# EAGLE design rcstick-f-pico2 (EAGLE 9.6.2)
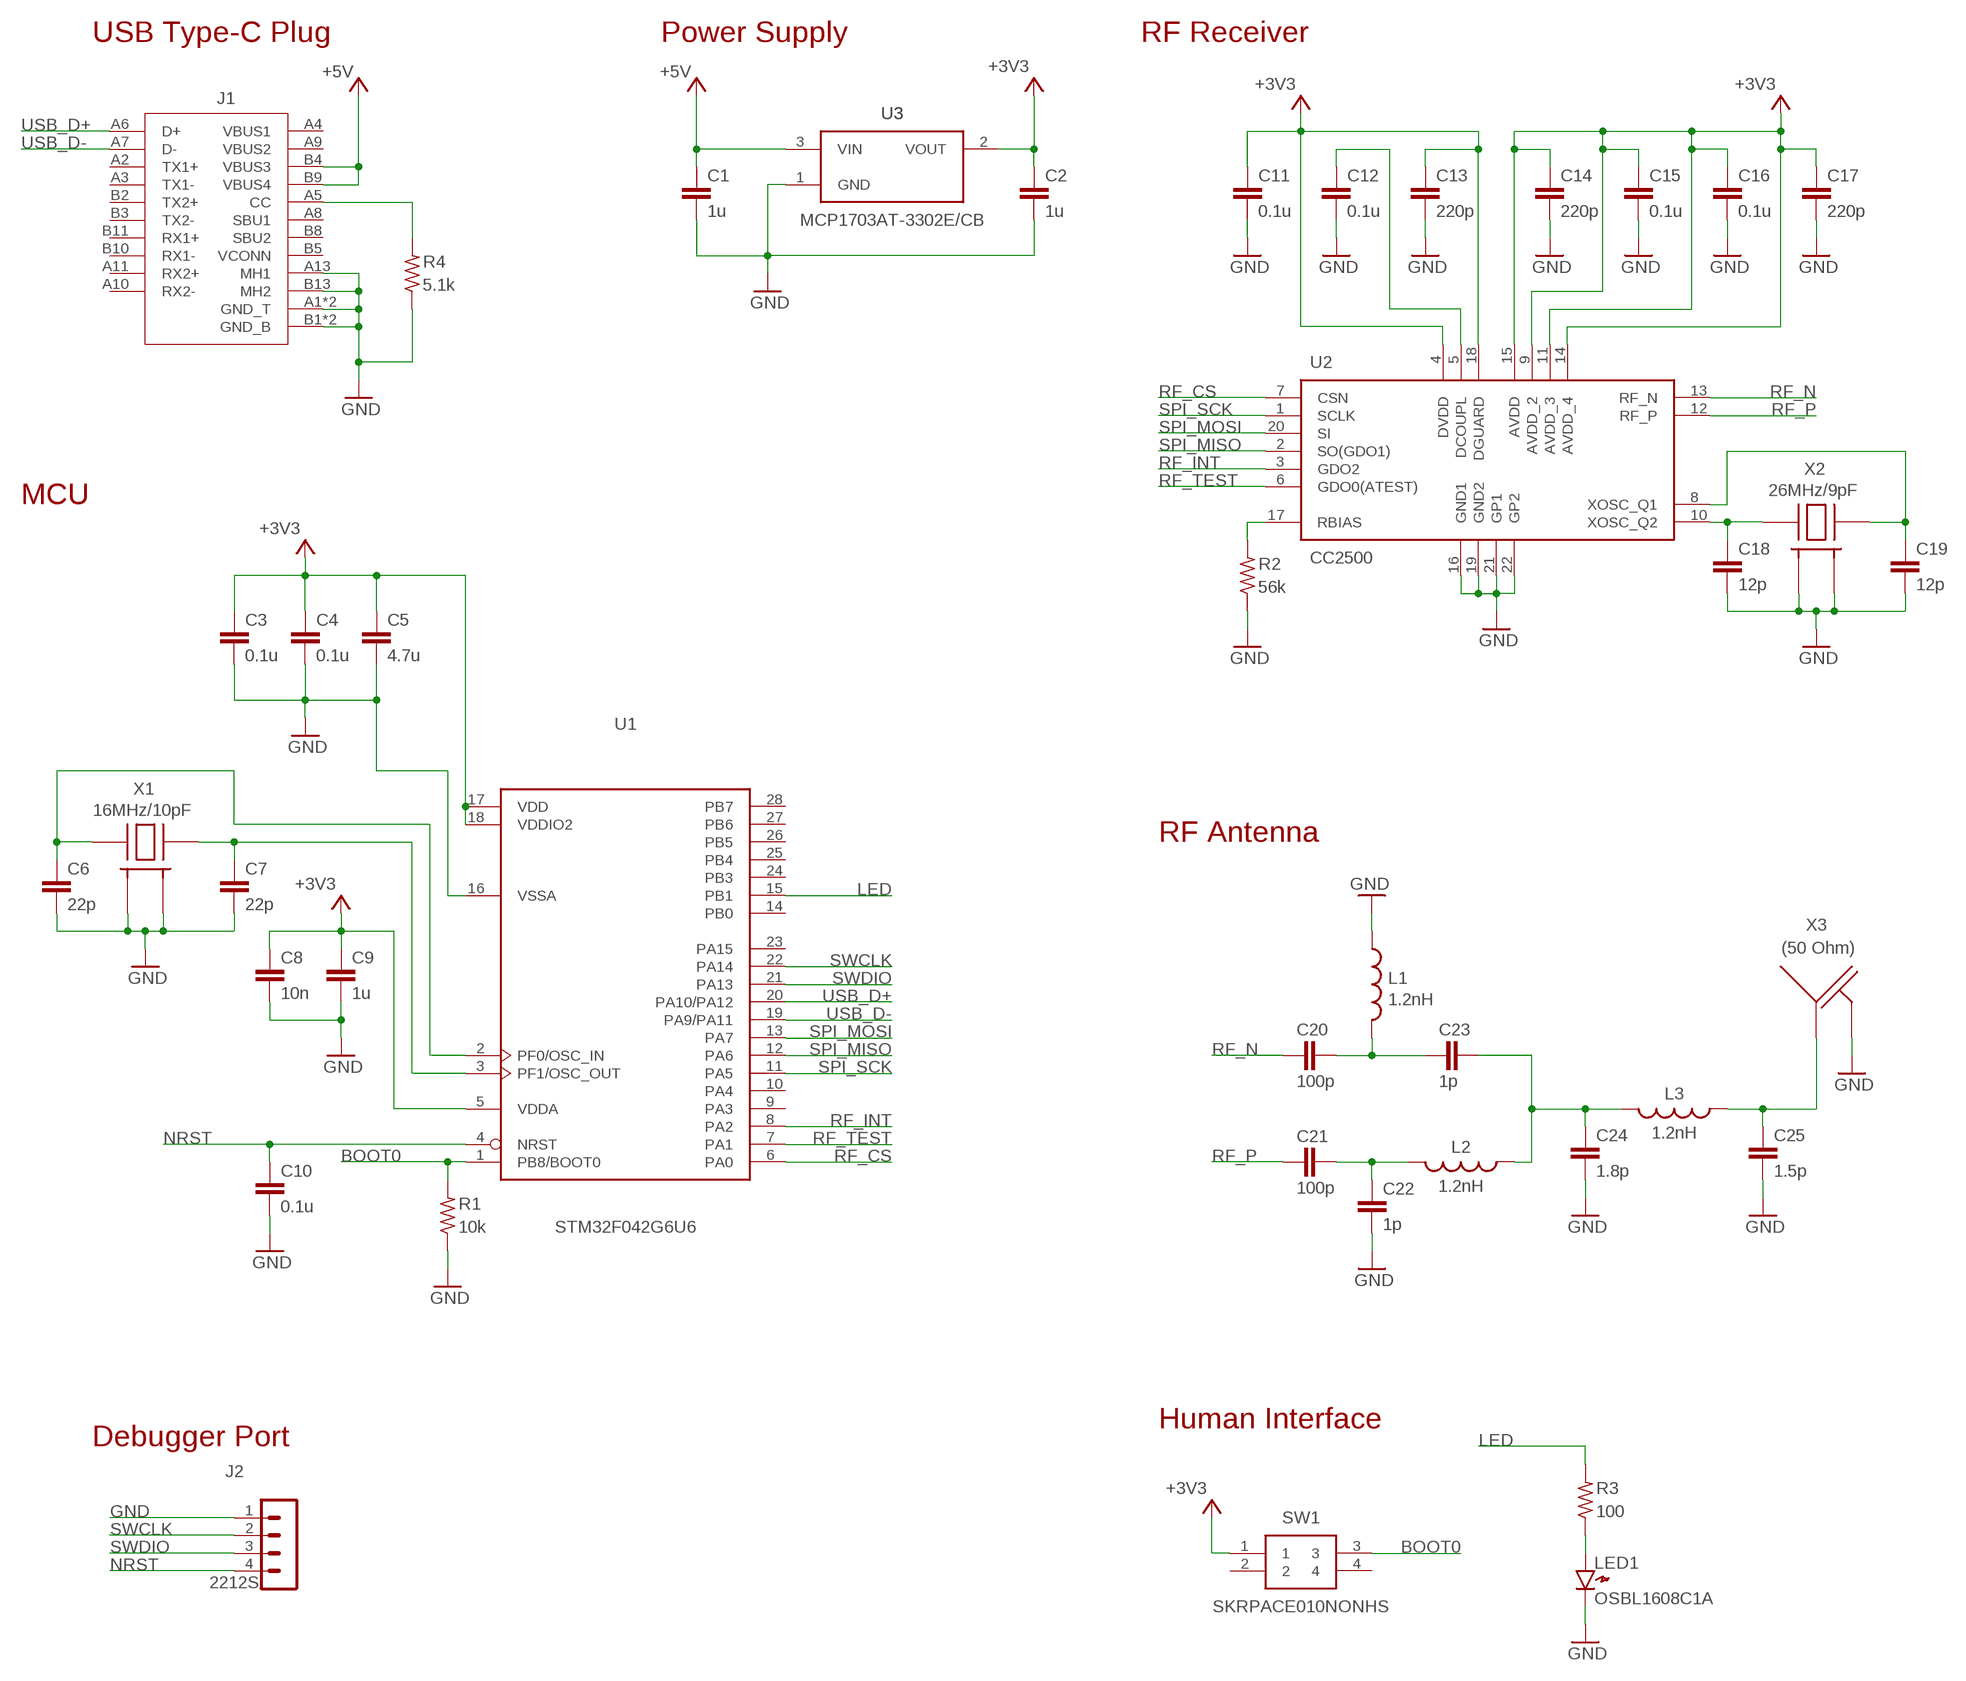
[diagram p0: schematic, sheet 1]

## Parts
C1  1u  RCL_C-EUC0402-HS  [RCL_C0402_HS]
C2  1u  RCL_C-EUC0402-HS  [RCL_C0402_HS]
C3  0.1u  RCL_C-EUC0402-HS  [RCL_C0402_HS]
C4  0.1u  RCL_C-EUC0402-HS  [RCL_C0402_HS]
C5  4.7u  RCL_C-EUC0402-HS  [RCL_C0402_HS]
C6  22p  RCL_C-EUC0402-HS  [RCL_C0402_HS]
C7  22p  RCL_C-EUC0402-HS  [RCL_C0402_HS]
C8  10n  RCL_C-EUC0402-HS  [RCL_C0402_HS]
C9  1u  RCL_C-EUC0402-HS  [RCL_C0402_HS]
C10  0.1u  RCL_C-EUC0402-HS  [RCL_C0402_HS]
C11  0.1u  RCL_C-EUC0402-HS  [RCL_C0402_HS]
C12  0.1u  RCL_C-EUC0402-HS  [RCL_C0402_HS]
C13  220p  RCL_C-EUC0402-HS  [RCL_C0402_HS]
C14  220p  RCL_C-EUC0402-HS  [RCL_C0402_HS]
C15  0.1u  RCL_C-EUC0402-HS  [RCL_C0402_HS]
C16  0.1u  RCL_C-EUC0402-HS  [RCL_C0402_HS]
C17  220p  RCL_C-EUC0402-HS  [RCL_C0402_HS]
C18  12p  RCL_C-EUC0402-HS  [RCL_C0402_HS]
C19  12p  RCL_C-EUC0402-HS  [RCL_C0402_HS]
C20  100p  RCL_C-EUC0402-HS  [RCL_C0402_HS]
C21  100p  RCL_C-EUC0402-HS  [RCL_C0402_HS]
C22  1p  RCL_C-EUC0402-HS  [RCL_C0402_HS]
C23  1p  RCL_C-EUC0402-HS  [RCL_C0402_HS]
C24  1.8p  RCL_C-EUC0402-HS  [RCL_C0402_HS]
C25  1.5p  RCL_C-EUC0402-HS  [RCL_C0402_HS]
J1  USB-TYPEC-1054440001-HS  [USB-TYPEC-1054440001-HS]
J2  2212S  53047-0410  [53047-0410]
L1  1.2nH  RCL_L-USL0402-HS  [RCL_L0402_HS]
L2  1.2nH  RCL_L-USL0402-HS  [RCL_L0402_HS]
L3  1.2nH  RCL_L-USL0402-HS  [RCL_L0402_HS]
LED1  OSBL1608C1A  LED1608_NOHS  [LED1608NONHS]
R1  10k  RCL_R-US_R0402-HS  [RCL_R0402_HS]
R2  56k  RCL_R-US_R0402-HS  [RCL_R0402_HS]
R3  100  RCL_R-US_R0402-HS  [RCL_R0402_HS]
R4  5.1k  RCL_R-US_R0402-HS  [RCL_R0402_HS]
SW1  SKRPACE010NONHS  [SMT(4.2X3.2)_ORG]
U1  STM32F042G6U6  STM32F042GU  [UFQFPN28]
U2  CC2500  [CC2500-RTY1_CC2500]
U3  MCP1703AT-3302E/CB  LDO-REGULATOR_NOHS  [SOT23_NOHS]
X1  16MHz/10pF  CRYSTAL3225  [CRYSTAL3225]
X2  26MHz/9pF  CRYSTAL3225  [CRYSTAL3225]
X3  (50 Ohm)  2.4GHZ-INVERED-FSMALL-FLIP  [2.4GHZ-INVERTED-F-SMALL-FLIP]

## Nets
+3V3 [pwr]: C2.1 C3.1 C4.1 C5.1 C8.1 C9.1 C11.1 C13.1 C14.1 C15.1 C16.1 C17.1 SW1.1 U1.5(VDDA) U1.17(VDD) U1.18(VDDIO2) U2.4(DVDD) U2.9(AVDD_2) U2.11(AVDD_3) U2.14(AVDD_4) U2.15(AVDD) U2.18(DGUARD) U3.2(VOUT)
+5V [pwr]: C1.1 J1.B4(VBUS3) J1.B9(VBUS4) U3.3(VIN)
BOOT0: R1.2 SW1.3 U1.1(PB8/BOOT0)
CC: J1.A5(CC) R4.2
DCOUPL: C12.1 U2.5(DCOUPL)
GND [gnd]: C1.2 C2.2 C3.2 C4.2 C5.2 C6.2 C7.2 C8.2 C9.2 C10.2 C11.2 C12.2 C13.2 C14.2 C15.2 C16.2 C17.2 C18.2 C19.2 C22.2 C24.2 C25.2 J1.A1(GND_T) J1.A12(GND_T) J1.A13(MH1) J1.B1(GND_B) J1.B12(GND_B) J1.B13(MH2) J2.1 L1.1 LED1.K R1.1 R2.1 R4.1 U1.16(VSSA) U2.16(GND1) U2.19(GND2) U2.21(GP1) U2.22(GP2) U3.1(GND) X1.2(GND_1) X1.4(GND_2) X2.2(GND_1) X2.4(GND_2) X3.2(GND)
LED: R3.2 U1.15(PB1)
N$1: LED1.A R3.1
N$5: C20.2 C23.1 L1.2
N$9: C21.2 C22.1 L2.2
N$10: C23.2 C24.1 L2.1 L3.2
N$11: C25.1 L3.1 X3.1(ANT)
NRST: C10.1 J2.4 U1.4(NRST)
OSC_IN: C6.1 U1.2(PF0/OSC_IN) X1.1(HOT_1)
OSC_OUT: C7.1 U1.3(PF1/OSC_OUT) X1.3(HOT_2)
RBIAS: R2.2 U2.17(RBIAS)
RF_CS: U1.6(PA0) U2.7(CSN)
RF_INT: U1.8(PA2) U2.3(GDO2)
RF_N: C20.1 U2.13(RF_N)
RF_P: C21.1 U2.12(RF_P)
RF_TEST: U1.7(PA1) U2.6(GDO0(ATEST))
SPI_MISO: U1.12(PA6) U2.2(SO(GDO1))
SPI_MOSI: U1.13(PA7) U2.20(SI)
SPI_SCK: U1.11(PA5) U2.1(SCLK)
SWCLK: J2.2 U1.22(PA14)
SWDIO: J2.3 U1.21(PA13)
USB_D+: J1.A6(D+) U1.20(PA10/PA12)
USB_D-: J1.A7(D-) U1.19(PA9/PA11)
XOSC1: C19.1 U2.8(XOSC_Q1) X2.3(HOT_2)
XOSC2: C18.1 U2.10(XOSC_Q2) X2.1(HOT_1)
Unconnected: J1.A2(TX1+) J1.A3(TX1-) J1.A4(VBUS1) J1.A8(SBU1) J1.A9(VBUS2) J1.A10(RX2-) J1.A11(RX2+) J1.B2(TX2+) J1.B3(TX2-) J1.B5(VCONN) J1.B8(SBU2) J1.B10(RX1-) J1.B11(RX1+) SW1.2 SW1.4 U1.9(PA3) U1.10(PA4) U1.14(PB0) U1.23(PA15) U1.24(PB3) U1.25(PB4) U1.26(PB5) U1.27(PB6) U1.28(PB7)

## Notes on the sheet
- USB Type-C Plug | Power Supply | RF Receiver
- MCU
- RF Antenna
- Human Interface
- Debugger Port

## Library data of the parts
C1-C25 = gen-discrete3:RCL_C-EU: CAPACITOR, European symbol
J1 = typec_connectors:USB-TYPEC-1054440001
J2 = connector:53047-0410: HEADER
L1-L3 = gen-discrete3:RCL_L-US: INDUCTOR, American symbol
LED1 = gen-discrete:LED: Generic LEDs
R1-R4 = gen-discrete3:RCL_R-US_: RESISTOR, American symbol
SW1 = SKRPACE010:SKRPACE010: Tactile Switches 4.2x3.2x2.5mm 260gf Source: Datasheet <http://www.alps.com/prod/info/E/HTML/Tact/SurfaceMount/SKRP/SKRPACE010.html>
U1 = stm32:STM32F042G*U
U2 = CC2500:CC2500: RF Transceiver Source: Datasheet
U3 = SOT23_Module:LDO-REGULATOR
X1 X2 = CRYSTAL3225:CRYSTAL3225: Crystals 3225
X3 = antenna:2.4GHZ-INVERED-F

## Net classes
1 gnd: width 0.2 mm
2 pwr: width 0.2 mm

## Board
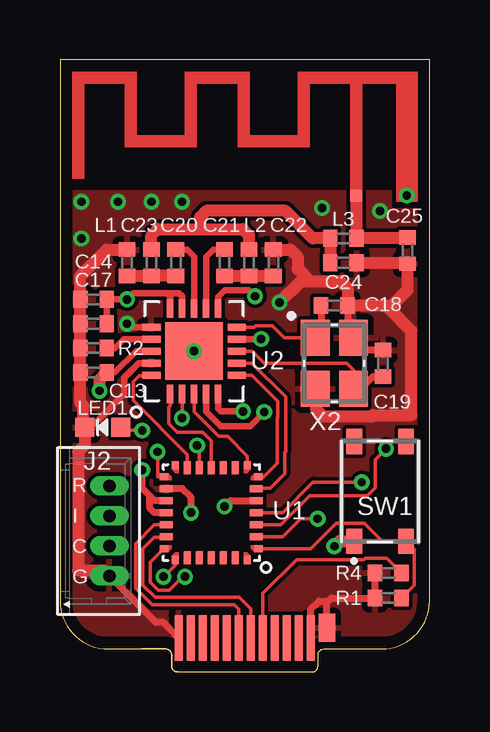
[diagram p1: board, top side]
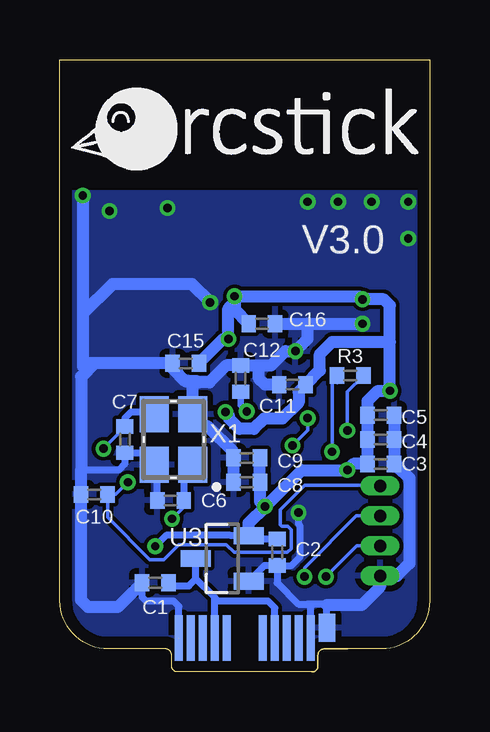
[diagram p2: board, bottom side, seen from below]

Size 15.4 x 25.5 mm. Coordinates in mm from the lower left corner, seen from the top.
Outline: 15.4,25.5 0,25.5 0,2.96 arc90 2,0.96 4.4,0.96 arc-90 4.65,0.71 4.65,0.25 arc90 4.9,0 10.5,0 arc90 10.75,0.25 10.75,0.71 arc-90 11,0.96 13.4,0.96 arc90 15.4,2.96 15.4,25.5
Copper layers (1*16): Top 0.035mm / dielectric 0.73mm / Bottom 0.035mm
Design rules "Elecrow_2-layer_PCB_eagle_rule *": minimum track width 6mil, minimum drill 12mil, track to track 6mil, track to pad 6mil, pad to pad 6mil, via to via 8mil, smd to smd 0mil, copper to edge 20mil, drill to drill 10mil, minimum pad ring 6mil, minimum via ring 6mil, stop-mask expansion 0mil, vias tented up to drill 100mil, thermal gap 10mil
tRestrict: area 3,13.5 to 4.2,13.7; area 10.1,12.5 to 12.8,13.2
bRestrict: area 9.4,9.4 to 12,10

### Footprints (pad centres in the part's own frame; a part is rotated, then mirrored left to right if it is on the bottom)
RCL_C0402_HS = smd 0.6 x 0.7: 1 -0.55,0; 2 0.55,0
USB-TYPEC-1054440001-HS = smd 0.345 x 1.9: A1 -2.75,0.59; A2 -2.25,0.59; A3 -1.75,0.59; A4 -1.25,0.59; A5 -0.75,0.59; A6 -0.25,0.59; A7 0.25,0.59; A8 0.75,0.59; A9 1.25,0.59; A10 1.75,0.59; A11 2.25,0.59; A12 2.75,0.59 | smd 0.69 x 1.15: A13 -3.42,0.16 | smd 0.345 x 1.9 bottom: B1 2.75,0.59; B2 2.25,0.59; B3 1.75,0.59; B4 1.25,0.59; B5 0.75,0.59; B8 -0.75,0.59; B9 -1.25,0.59; B10 -1.75,0.59; B11 -2.25,0.59; B12 -2.75,0.59 | smd 0.69 x 1.15 bottom: B13 3.42,0.16
53047-0410 = drill 0.508 long: 1 1.875,0; 2 0.625,0; 3 -0.625,0; 4 -1.875,0
RCL_L0402_HS = smd 0.6 x 0.7: 1 -0.55,0; 2 0.55,0
LED1608NONHS = smd 0.8 x 0.8: A -0.75,0; K 0.75,0
RCL_R0402_HS = smd 0.6 x 0.7: 1 -0.55,0; 2 0.55,0
SMT(4.2X3.2)_ORG = smd 1.05 x 0.65: 1 -2.075,1.075; 2 2.075,1.075; 3 -2.075,-1.075; 4 2.075,-1.075
UFQFPN28 = smd 0.35 x 0.3: 1 -1.975,1.5; 7 -1.975,-1.5; 15 1.975,-1.5; 21 1.975,1.5 | smd 0.55 x 0.3: 2 -1.875,1; 3 -1.875,0.5; 4 -1.875,0; 5 -1.875,-0.5; 6 -1.875,-1; 16 1.875,-1; 17 1.875,-0.5; 18 1.875,0; 19 1.875,0.5; 20 1.875,1 | smd 0.3 x 0.35: 8 -1.5,-1.975; 14 1.5,-1.975; 22 1.5,1.975; 28 -1.5,1.975 | smd 0.3 x 0.55: 9 -1,-1.875; 10 -0.5,-1.875; 11 0,-1.875; 12 0.5,-1.875; 13 1,-1.875; 23 1,1.875; 24 0.5,1.875; 25 0,1.875; 26 -0.5,1.875; 27 -1,1.875
CC2500-RTY1_CC2500 = smd 0.78 x 0.28: 1 -1.78,1; 2 -1.78,0.5; 3 -1.78,0; 4 -1.78,-0.5; 5 -1.78,-1 | smd 0.28 x 0.76: 6 -1,-1.78; 7 -0.5,-1.78; 8 0,-1.78; 9 0.5,-1.78; 10 1,-1.78; 16 1,1.78; 17 0.5,1.78; 18 0,1.78; 19 -0.5,1.78; 20 -1,1.78 | smd 0.76 x 0.28: 11 1.78,-1; 12 1.78,-0.5; 13 1.78,0; 14 1.78,0.5; 15 1.78,1 | smd 2.4 x 2.4: 21 0,0 | drill 0.35: 22 0,0
SOT23_NOHS = smd 0.7 x 1.25: 1 -0.95,-1.1; 2 0.95,-1.1; 3 0,1.1
CRYSTAL3225 = smd 1.5 x 1.2: 1 -1.06,-0.8; 2 1.06,-0.8; 3 1.06,0.8; 4 -1.06,0.8
2.4GHZ-INVERTED-F-SMALL-FLIP = smd 0.5 x 0.5: 1 12.35,-5.45 | drill 0.35 pad 0.5: 2 14.45,-5.45

### Placement (x,y rotation side)
C1  11.43,3.71 180 bottom
C2  6.35,4.99 270 bottom
C3  2.03,8.67 0 bottom
C4  2.03,9.68 0 bottom
C5  2.03,10.7 0 bottom
C6  10.79,7.14 180 bottom
C7  12.7,9.68 270 bottom
C8  7.62,7.91 180 bottom
C9  7.62,8.92 180 bottom
C10  13.97,7.4 180 bottom
C11  5.71,11.97 180 bottom
C12  7.87,12.22 90 bottom
C13  1.4,12.48 180 top
C14  1.4,15.53 180 top
C15  10.16,12.86 180 bottom
C16  6.99,14.51 0 bottom
C17  1.4,14.51 180 top
C18  11.43,15.27 0 top
C19  13.46,12.86 90 top
C20  4.83,17.05 270 top
C21  6.86,17.05 270 top
C22  8.89,17.05 90 top
C23  3.81,17.05 90 top
C24  11.81,17.05 0 top
C25  14.48,17.56 270 top
J1  7.7,2 180 top
J2  2.06,5.87 270 top
L1  2.79,17.05 270 top
L2  7.87,17.05 270 top
L3  11.81,18.07 180 top
LED1  1.78,10.19 180 top
R1  13.68,3.08 0 top
R2  1.4,13.49 0 top
R3  3.3,12.35 180 bottom
R4  13.68,4.12 0 top
SW1  13.34,7.53 90 top
U1  6.3,6.64 180 top
U2  5.59,13.37 90 top
U3  8.64,4.73 90 bottom
U$1  [RCSTICK-LOGO]  15.37,18.45 0 bottom
X1  10.67,9.68 90 bottom
X2  11.43,12.86 270 top
X3  0,25.3 0 top

### Tracks (layer width: path | path; a pad name or v marks a point on that pad's centre or on a via)
+3V3  (via drill 0.35)
  Top 0.28: v8.38,13.88 v8.37,13.87 U2.9 | C17.1 C14.1 v2.79,15.53 3.05,15.78 4.45,15.78 | U2.15 4.59,15.64 4.45,15.78 | U2.14 5.09,15.64 4.95,15.78 4.45,15.78 | U2.11 6.59,15.64 6.86,15.91 7.87,15.91 v8.13,15.65 | U2.4 6.1,10.85 6.71,10.24 7.92,10.24 v8.51,10.83 | C13.1 2.29,12.48 3.17,13.37 U2.18
  Top 0.3: v6.86,6.89 7.1,7.14 U1.5 | U1.17 3.94,7.14 3.75,7.33 | v3.43,8.41 3.43,7.65 3.75,7.33 | U1.18 3.94,6.64 3.75,6.83 3.75,7.33
  Top 0.5: v1.65,11.72 1.65,12.18 C13.1 | v11.43,5.24 11.64,5.45 SW1.1
  Bottom 0.3: v11.43,5.24 10.98,5.69 8.31,5.69 8.3,5.68 U3.2 7.39,5.54 C2.1
  Bottom 0.5: C15.1 8.59,13.88 v8.38,13.88 8.38,15.14 8.13,15.4 v8.13,15.65 | v8.13,15.65 2.92,15.65 v2.79,15.53 1.91,15.53 1.65,15.27 1.65,13.75 | v8.13,15.65 8.13,15.1 C16.1 | 1.65,13.75 v1.65,11.72 2.16,11.72 2.58,11.29 C5.1 C4.1 C3.1 3.17,8.67 v3.43,8.41 5.33,8.41 v6.86,6.89 | v8.51,10.83 8.35,10.67 8.35,10.56 7.92,10.13 7.32,10.13 6.89,10.56 6.13,10.56 5.46,11.22 5.46,11.67 C11.1 4.57,12.56 4.57,13.24 4.06,13.75 1.65,13.75 | U3.2 7.54,6.21 v6.86,6.89 | v6.86,6.89 7.07,7.1 C8.1 C9.1
+5V
  Bottom 0.3: C1.1 10.75,3.59 10.03,3.59 9.74,3.88 | 9.74,3.88 U3.3 | J1.B4 6.45,2.67 6.73,2.95 8.8,2.95 8.95,3.1 | 9.74,3.88 8.97,3.12 8.95,3.1 | J1.B9 8.95,3.1
  Bottom 0.5: 9.82,4.82 U3.3 9.82,4.65
BOOT0
  Top 0.152: 14.35,3.08 R1.2 14.76,3.61 14.76,5.1 SW1.3 13.43,5.45 12.68,6.2 11.51,6.2 10.44,5.14 U1.1
CC
  Top 0.152: J1.A5 8.45,3.28 9.86,4.68 12.67,4.68 12.71,4.73 13.62,4.73 R4.2
DCOUPL  (via drill 0.35)
  Top 0.28: U2.5 6.59,10.97 6.7,10.86 v7.62,10.86
  Bottom 0.28: C12.1 7.87,11.11 v7.62,10.86
GND  (via drill 0.35)  (1 unrouted)
  Top 0.28: U2.16 2.94,14.37 v2.79,14.51 | U2.19 3.29,12.86 2.68,12.25 2.68,11.59 1.28,10.19 LED1.K
  Top 0.3: C19.2 12.74,13.41 X2.4 | C18.2 11.98,14.37 | v5.46,6.64 5.46,7.27 5.1,7.64 U1.16 | 0.97,11.08 0.85,11.21 | J1.B1 4.3,2.06 4,2.06 J2.1 | J1.B12 10.45,2.61 10.79,2.95 11.18,2.95 | R4.1 R1.1 11.3,3.08 11.18,2.95 | J1.A13 11.12,2.9 11.18,2.95
  Top 0.5: 13.72,15.14 14.64,14.22 14.64,10.7 13.05,10.7 13,10.65 10.97,10.65 10.67,10.95 10.67,11.76 X2.2 | 11.98,14.37 X2.4 12.23,13.41 | C17.2 0.89,14.55 | C18.2 11.94,15.31 | C17.2 R2.1 C13.2 0.85,11.21 | C17.2 C14.2 0.85,16.5 1.95,17.6 L1.1 | C22.2 9.61,17.6 9.91,17.3 9.91,16.8 10.41,16.29 | 10.41,16.29 11.68,16.29 11.98,15.99 C18.2 | C24.2 14.44,17.05 C25.2 14.48,15.91 13.72,15.14 | 0.97,11.08 0.97,10.25 LED1.K 1.03,9.44 0.76,9.17 0.76,4.22 1.84,4.22 J2.1 | v9.14,15.4 10.03,16.29 10.41,16.29 | C18.2 13.59,15.27 13.72,15.14
  Bottom 0.3: 11.55,8.54 X1.4 | C6.2 11.35,8.34 11.55,8.54 | 11.55,8.54 11.55,8.71 11.65,8.8 11.65,9.02 11.81,9.18 11.85,9.13 C7.2 12.7,8.67 12.95,8.41 14.52,8.41 | C2.2 6.28,4.5 | J1.B12 10.45,2.74 10.67,2.95 11.81,2.95 11.98,3.12 C1.2 | J1.B1 4.95,2.7 5.08,2.83 | 5.08,2.83 5.47,2.83 6.35,3.71 C2.2 | J1.B13 4.28,2.79 4.32,2.83 5.08,2.83 | C2.2 6.88,4.44 U3.1 | C2.2 5.76,4.44 5.39,4.8 5.39,6.09 5.46,6.16 v5.46,6.64
  Bottom 0.345: J1.B13 4.46,2.02
  Bottom 0.5: X3.2 14.45,14.92 | 14.45,14.92 14.45,12.73 | C12.2 7.11,12.77 | 7.11,12.77 6.6,12.77 6.01,13.37 U2.22 5.08,13.88 5.08,14.51 | C12.2 7.94,12.77 | 13.97,12.86 C15.2 10.71,12.65 10.16,12.1 10.15,12.11 9.65,12.11 9.61,12.07 | 13.97,12.86 14.32,12.86 | C16.2 5.08,14.51 | 5.08,14.51 v2.79,14.51 | C12.2 8.47,12.77 9.17,12.07 9.61,12.07 | 9.61,12.07 9.87,12.07 X1.2 9.37,10.24 9.27,10.24 8.17,9.15 C9.2 C8.2 | C11.2 6.86,11.97 7.11,12.22 7.11,12.77 | 13.97,12.86 14.52,12.31 14.52,8.41 C10.2 14.52,3 14.22,2.7 13,2.7 C1.2 | J2.1 2.06,3.56 2.83,2.79 4.28,2.79 | 2,4 J2.1 | v9.14,15.4 9.91,16.16 13.21,16.16 14.45,14.92 | C5.2 C4.2 C3.2 1.37,8.56 1.32,8.56 0.85,8.08 0.85,4.52 1.37,4 J2.1
  other vias: 13.34,19.21 10.92,19.34 5.08,19.59 3.81,19.59 2.41,19.59 0.89,19.59 0.89,18.07
  pour Top: 0,-5.43 15.49,-5.43 15.49,20.35 0,20.35
  pour Bottom: -0.38,-5.81 15.88,-5.81 15.88,20.73 -0.38,20.73
LED  (via drill 0.35)
  Top 0.152: U1.15 4.06,8.14 v4.06,9.18
  Bottom 0.152: 3.85,12.05 R3.2 4.06,12.14 v4.06,9.18
N$1  (via drill 0.35)
  Top 0.152: v3.43,10.07 2.65,10.07 LED1.A
  Bottom 0.152: 2.75,12.27 R3.1 3.43,11.67 v3.43,10.07
N$5
  Top 0.5: C20.2 C23.1 L1.2
N$9
  Top 0.5: C21.2 L2.2 C22.1
N$10
  Top 0.5: C23.2 3.81,18.19 4.06,18.45 5.84,18.45 | L2.1 7.87,18.19 7.62,18.45 5.84,18.45 | 5.84,18.45 5.84,18.96 6.1,19.21 9.4,19.21 10.54,18.07 L3.2 C24.1
N$11
  Top 0.5: C25.1 14.44,18.07 L3.1 X3.1
NRST  (via drill 0.35)
  Top 0.152: U1.4 9.27,6.64 10.54,7.91 v12.57,7.91
  Bottom 0.152: v12.57,7.91 13.08,7.4 C10.1 13.42,6.44 11.66,4.68 11.08,4.68 10.46,5.31 8.46,5.31 8.14,4.99 5.93,4.99 5.77,5.14 5.77,5.93 5.91,6.06 6.16,6.06 6.22,6.13 6.22,6.76 5.21,7.78 2.09,7.78 J2.4
OSC_IN  (via drill 0.35)
  Top 0.152: U1.2 8.37,5.64 | 8.19,5.62 U1.2 | U1.2 9.29,5.64 10.03,6.38 v10.73,6.38
  Bottom 0.152: C6.1 10.24,6.87 v10.73,6.38
  Bottom 0.3: X1.1 10.24,8.25 C6.1
OSC_OUT  (via drill 0.35)
  Top 0.152: U1.3 9.2,6.14 10.42,7.35 12.8,7.35 13.13,7.68 13.13,8.84 v13.59,9.3
  Bottom 0.152: C7.1 12.7,10.19 v13.59,9.3
  Bottom 0.3: X1.3 11.55,10.83 12.45,10.83 12.7,10.57 C7.1
RBIAS
  Top 0.28: U2.17 2.66,13.87 2.29,13.49 R2.2
RF_CS
  Top 0.152: U1.6 8.19,7.65 8.76,7.65 9.36,8.25 9.36,9.15 9.4,9.18 9.4,11.46 7.99,12.87 U2.7
RF_INT
  Top 0.152: U1.8 7.8,8.99 6.99,9.81 6.61,9.81 5.59,10.84 U2.3
RF_N
  Top 0.28: C20.1 5.29,17.6 5.59,17.3 U2.13
RF_P
  Top 0.28: U2.12 6.09,17.3 6.39,17.6 C21.1
RF_TEST
  Top 0.152: U2.6 7.99,12.37 9.06,11.29 9.06,10.6 9.05,10.59 9.05,8.7 8.49,8.14 U1.7
SPI_MISO  (via drill 0.35)
  Top 0.152: U2.2 v5.09,10.58 v5.08,10.57 | U1.12 5.8,9.34 v5.71,9.43
  Bottom 0.152: v5.71,9.43 5.08,10.07 v5.08,10.57
SPI_MOSI
  Top 0.152: U2.20 3.79,12.35 3.3,12.35 3.05,12.1 3.05,11.31 5.3,9.06 U1.13
SPI_SCK
  Top 0.152: U1.11 6.3,9.63 5.95,9.99 4.88,9.99 4.52,10.34 4.52,11.03 4.59,11.1 U2.1
SWCLK  (via drill 0.35)
  Top 0.152: U1.22 4.8,4.45 v4.32,3.97
  Bottom 0.152: v4.32,3.97 3.04,5.25 J2.2
SWDIO  (via drill 0.35)
  Top 0.152: U1.21 3.76,4.57 3.76,3.74 4.09,3.41 4.55,3.41 5.1,3.97 v5.21,3.97
  Bottom 0.152: J2.3 3.06,6.5 5.21,4.35 v5.21,3.97
USB_D+
  Top 0.152: 7.95,2.1 J1.A6 7.95,2.62 7.46,3.11 3.96,3.11 3.46,3.61 3.46,5.14 3.94,5.62 4.41,5.62 U1.20
USB_D-
  Top 0.152: 7.45,2.1 J1.A7 7.45,2.62 7.26,2.8 3.83,2.8 3.15,3.49 3.15,5.34 3.94,6.13 U1.19
XOSC1
  Top 0.152: 7.6,13.37 U2.8 8,13.37 8.51,12.86 11.94,12.86 12.23,12.57 X2.3
  Top 0.3: C19.1 13.04,12.31 12.36,11.63
  Top 0.5: 12.36,11.63 X2.3
XOSC2
  Top 0.152: 10.56,14.05 X2.1 9.35,13.92 8.84,14.43 8.15,14.43 8.09,14.37 U2.10
  Top 0.3: C18.1 10.88,14.17 X2.1
  Top 0.5: 10.88,14.37 X2.1

### Text on the board
bPlace: V3.0
tNames: LED1 | R | I | C | G